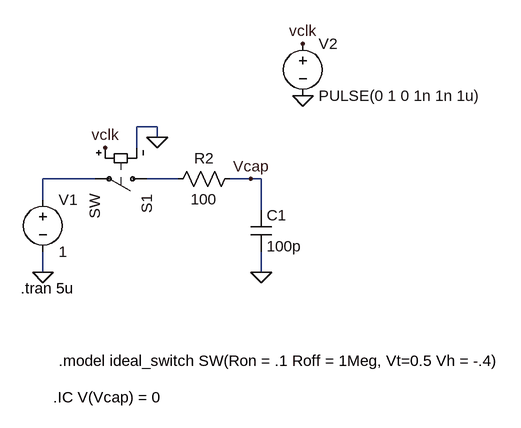
[diagram p0: schematic HW1_3.asc]
HW1_3.asc, the LTspice schematic file:
Version 4
SHEET 1 880 680
WIRE 208 64 176 64
WIRE 208 80 208 64
WIRE 176 96 176 64
WIRE 112 144 32 144
WIRE 240 144 192 144
WIRE 352 144 320 144
WIRE 368 144 352 144
WIRE 32 176 32 144
WIRE 368 192 368 144
WIRE 32 288 32 256
WIRE 368 288 368 256
FLAG 368 288 0
FLAG 32 288 0
FLAG 208 80 0
FLAG 432 16 0
FLAG 432 -64 vclk
FLAG 128 96 vclk
FLAG 352 144 Vcap
SYMBOL sw 208 144 R90
SYMATTR InstName S1
SYMATTR SpiceModel ideal_switch
SYMBOL res 336 128 R90
WINDOW 0 0 56 VBottom 2
WINDOW 3 32 56 VTop 2
SYMATTR InstName R2
SYMATTR Value 100
SYMBOL cap 352 192 R0
SYMATTR InstName C1
SYMATTR Value 100p
SYMBOL voltage 32 160 R0
WINDOW 123 0 0 Left 0
WINDOW 39 0 0 Left 0
SYMATTR InstName V1
SYMATTR Value 1
SYMBOL voltage 432 -80 R0
WINDOW 123 0 0 Left 0
WINDOW 39 0 0 Left 0
SYMATTR InstName V2
SYMATTR Value PULSE(0 1 0 1n 1n 1u)
TEXT -2 312 Left 2 !.tran 5u
TEXT 56 424 Left 2 !.model ideal_switch SW(Ron = .1 Roff = 1Meg, Vt=0.5 Vh = -.4)
TEXT 48 480 Left 2 !.IC V(Vcap) = 0

The netlist it stands for:
* HW1_3.asc
S1 N002 N001 vclk 0 ideal_switch SW
R2 Vcap N002 100
C1 Vcap 0 100p
V1 N001 0 1
V2 vclk 0 PULSE(0 1 0 1n 1n 1u)
.tran 5u
.model ideal_switch SW(Ron = .1 Roff = 1Meg, Vt=0.5 Vh = -.4)
.IC V(Vcap) = 0
.backanno
.end